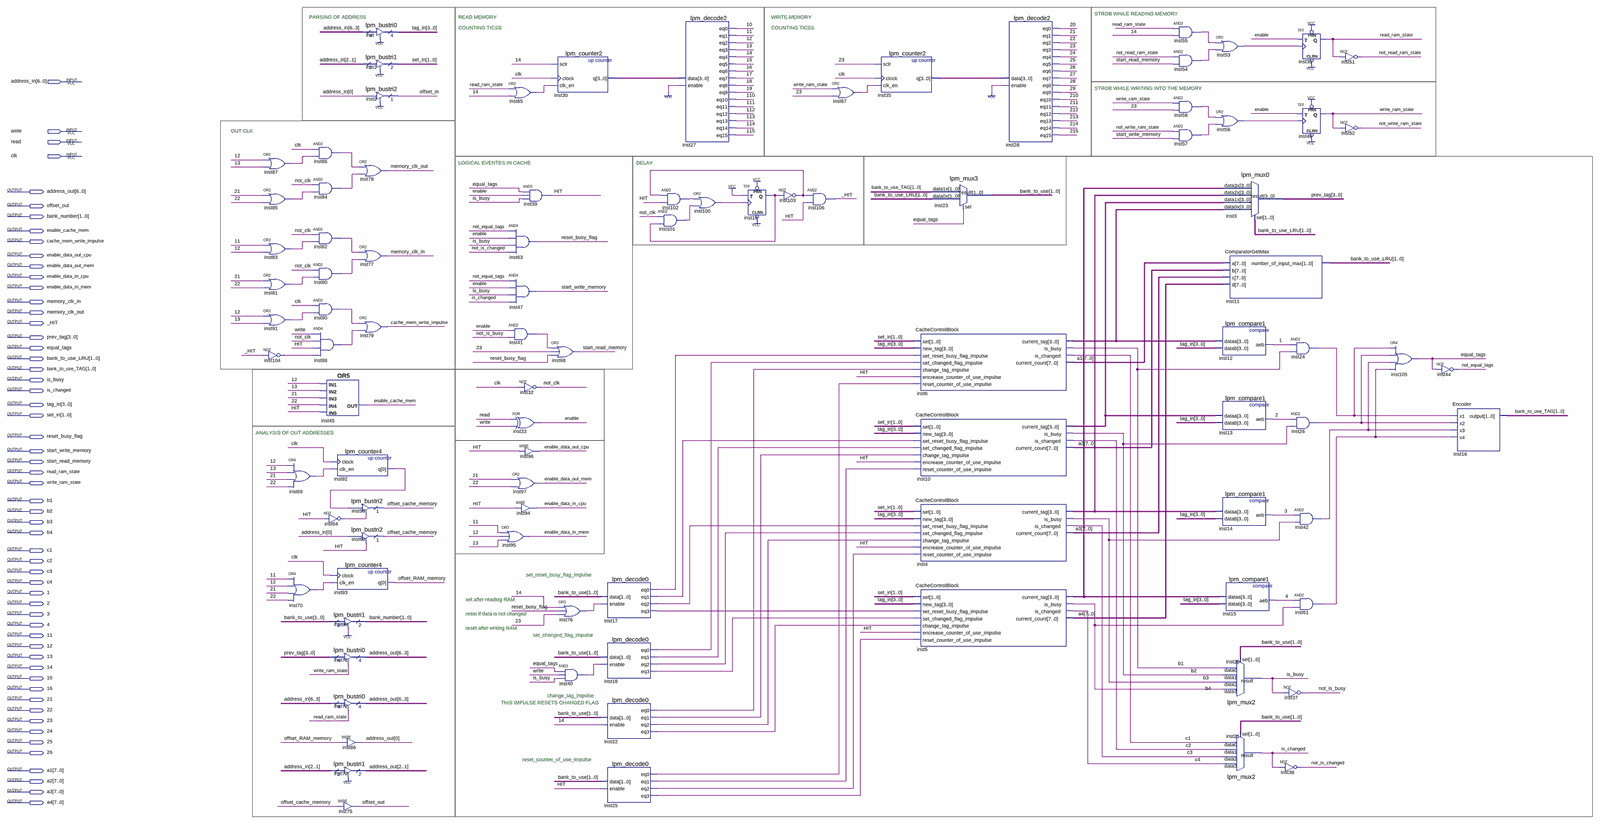
[diagram p0: schematic sheet, whole]
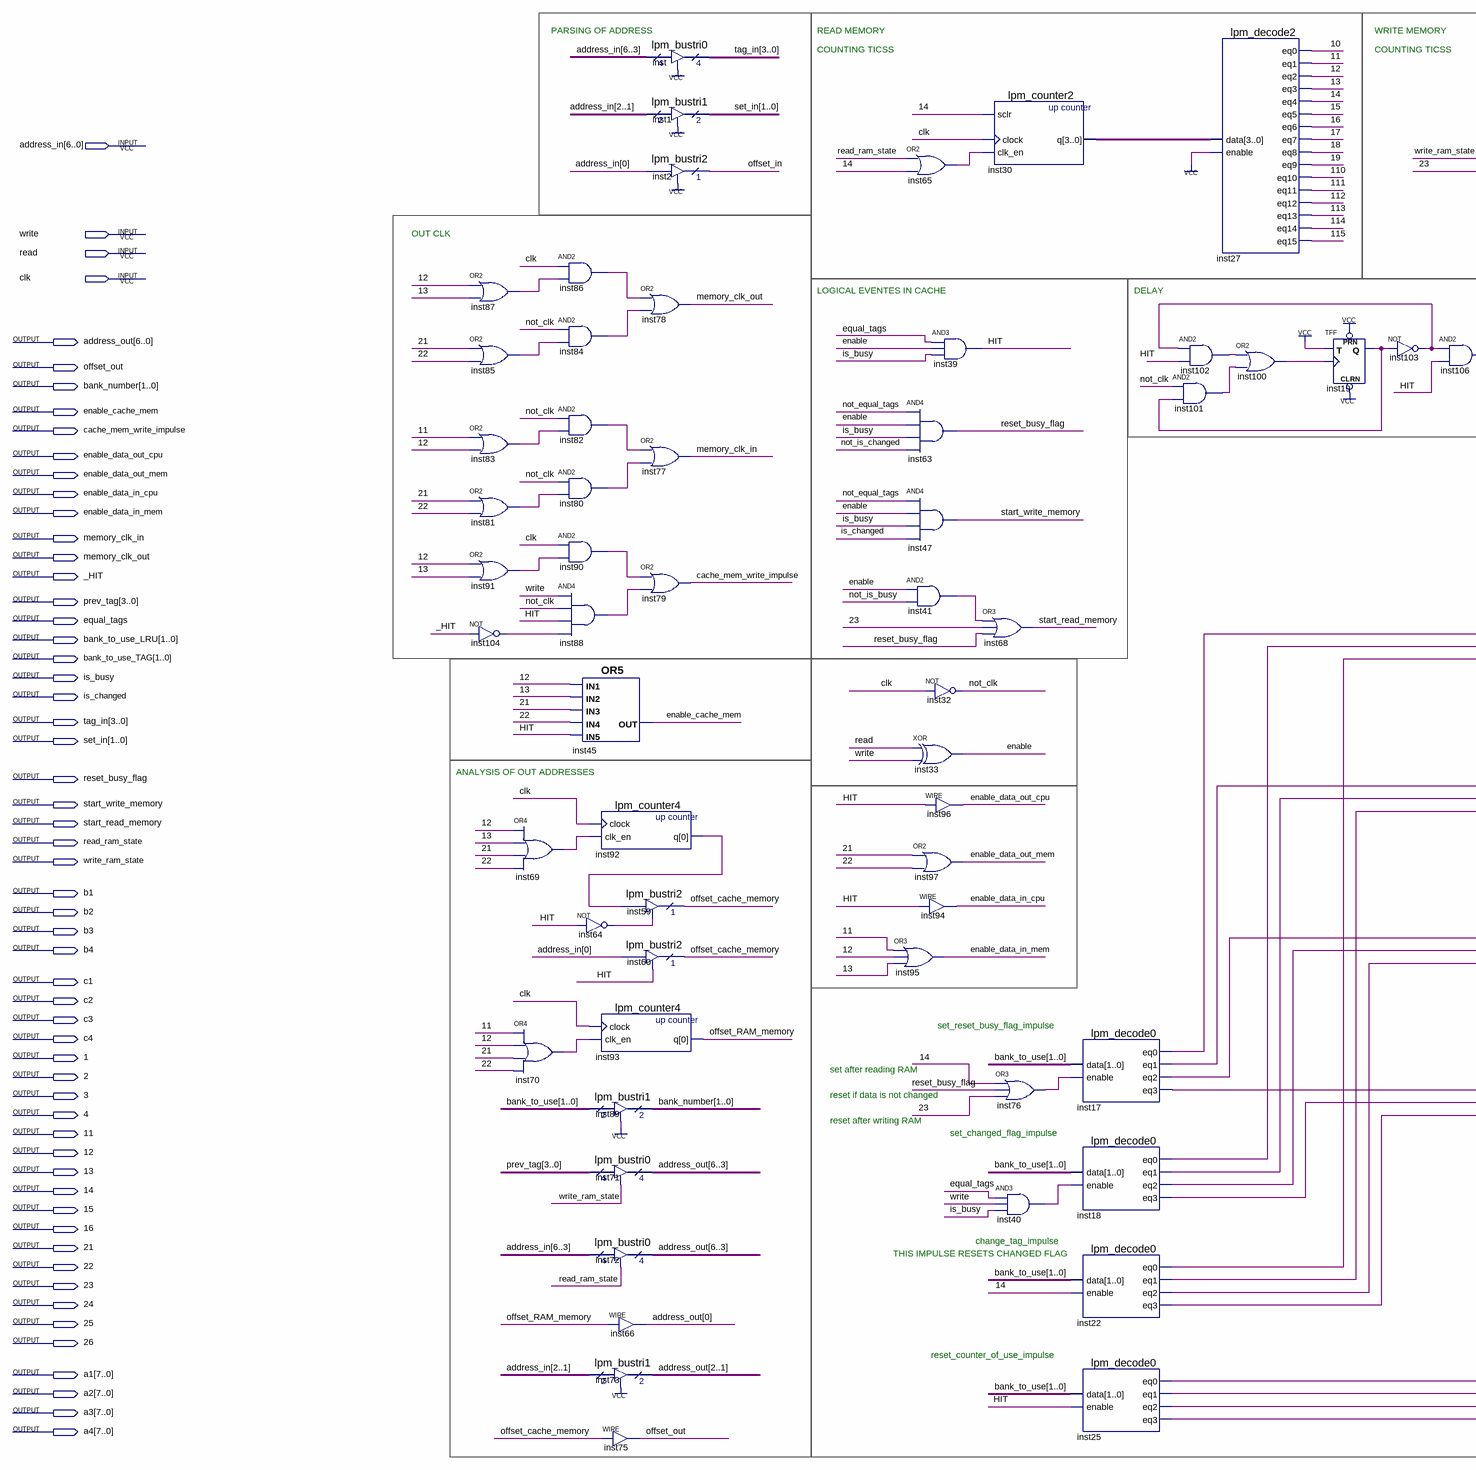
[diagram p1: schematic sheet, left part]
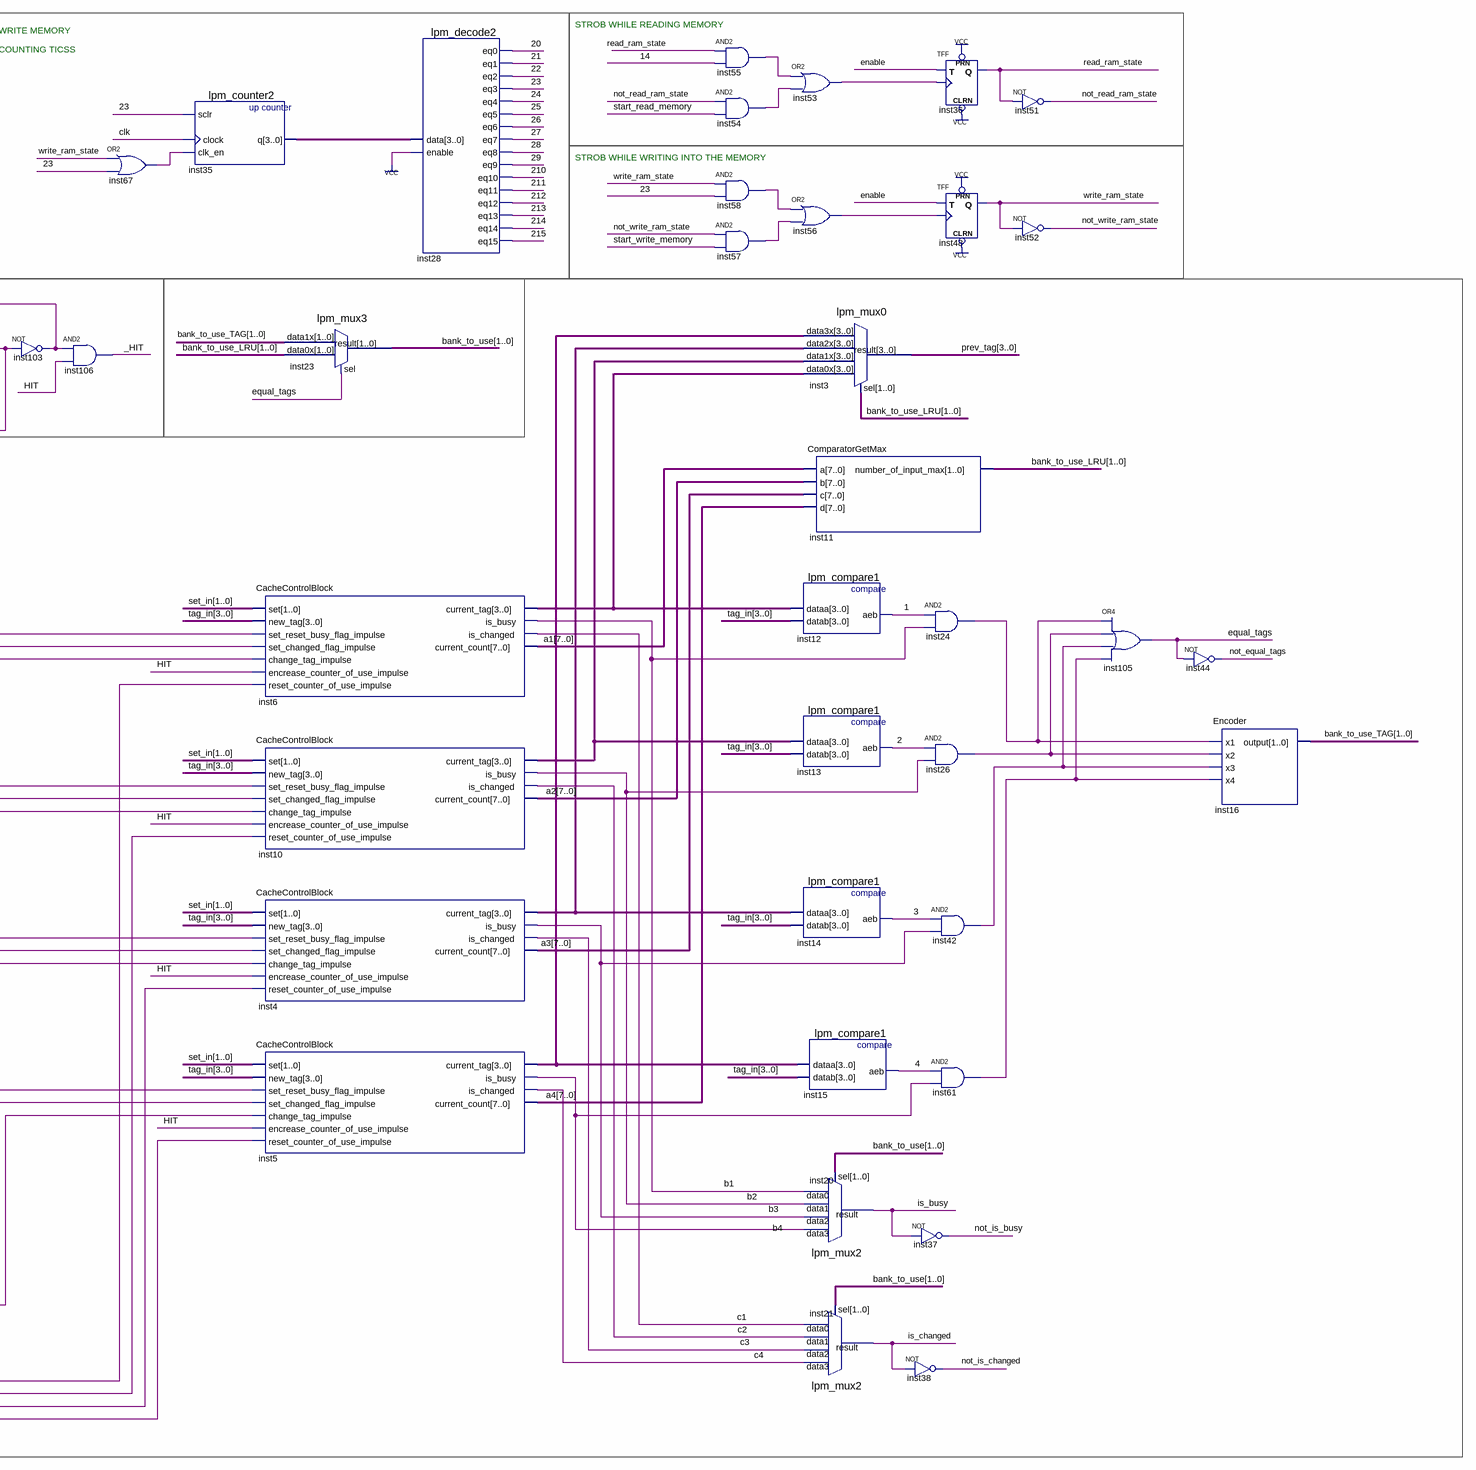
[diagram p2: schematic sheet, right part]
// Quartus schematic CacheControlUnit.bdf as structural Verilog: 93 symbols, 57 pins
module CacheControlUnit (
  input  [6:0] address_in,
  input  write,
  input  read,
  input  clk,
  output [6:0] address_out,
  output offset_out,
  output [1:0] bank_number,
  output enable_cache_mem,
  output cache_mem_write_impulse,
  output enable_data_out_cpu,
  output enable_data_out_mem,
  output enable_data_in_cpu,
  output enable_data_in_mem,
  output memory_clk_in,
  output memory_clk_out,
  output _HIT,
  output [3:0] prev_tag,
  output equal_tags,
  output [1:0] bank_to_use_LRU,
  output [1:0] bank_to_use_TAG,
  output is_busy,
  output is_changed,
  output [3:0] tag_in,
  output [1:0] set_in,
  output reset_busy_flag,
  output start_write_memory,
  output start_read_memory,
  output read_ram_state,
  output write_ram_state,
  output b1,
  output b2,
  output b3,
  output b4,
  output c1,
  output c2,
  output c3,
  output c4,
  output \1 ,
  output \2 ,
  output \3 ,
  output \4 ,
  output \11 ,
  output \12 ,
  output \13 ,
  output \14 ,
  output \15 ,
  output \16 ,
  output \21 ,
  output \22 ,
  output \23 ,
  output \24 ,
  output \25 ,
  output \26 ,
  output [7:0] a1,
  output [7:0] a2,
  output [7:0] a3,
  output [7:0] a4
);

  wire \10 , \17 , \18 , \19 , \20 , \27 , \28 , \29 , \110 , \111 , \112 , \113 , \114 , \115 , \210 ,
       \211 , \212 , \213 , \214 , \215 , enable, HIT, inst17_eq0, inst17_eq1, inst17_eq2, inst17_eq3,
       inst18_eq0, inst18_eq1, inst18_eq2, inst18_eq3, inst19_q, inst22_eq0, inst22_eq1, inst22_eq2,
       inst22_eq3, inst24_out, inst25_eq0, inst25_eq1, inst25_eq2, inst25_eq3, inst26_out, inst40_out,
       inst41_out, inst42_out, inst53_out, inst54_out, inst55_out, inst56_out, inst57_out, inst58_out,
       inst61_out, inst64_out, inst65_out, inst67_out, inst69_out, inst70_out, inst76_out, inst80_out,
       inst81_out, inst82_out, inst83_out, inst84_out, inst85_out, inst86_out, inst87_out, inst88_out,
       inst90_out, inst91_out, inst92_q, inst100_out, inst101_out, inst102_out, inst103_out, inst104_out,
       not_clk, not_equal_tags, not_is_busy, not_is_changed, not_read_ram_state, not_write_ram_state,
       offset_cache_memory, offset_in, offset_RAM_memory;
  wire [1:0] bank_to_use;
  wire [3:0] inst4_current_tag, inst5_current_tag, inst6_current_tag, inst10_current_tag, inst30_q, inst35_q;

  or inst87 (inst87_out, \12 , \13 );
  or inst85 (inst85_out, \21 , \22 );
  or inst83 (inst83_out, \11 , \12 );
  or inst81 (inst81_out, \21 , \22 );
  or inst91 (inst91_out, \12 , \13 );
  not inst104 (inst104_out, _HIT);
  or inst69 (inst69_out, \12 , \13 , \21 , \22 );
  or inst70 (inst70_out, \11 , \12 , \21 , \22 );
  and inst86 (inst86_out, clk, inst87_out);
  and inst84 (inst84_out, not_clk, inst85_out);
  and inst82 (inst82_out, not_clk, inst83_out);
  and inst80 (inst80_out, not_clk, inst81_out);
  and inst90 (inst90_out, clk, inst91_out);
  and inst88 (inst88_out, write, not_clk, HIT, inst104_out);
  or inst45 (enable_cache_mem, \12 , \13 , \21 , \22 , HIT);
  lpm_counter4 inst92 (.clock(clk), .clk_en(inst69_out), .q(inst92_q));
  not inst64 (inst64_out, HIT);
  lpm_counter4 inst93 (.clock(clk), .clk_en(inst70_out), .q(offset_RAM_memory));
  lpm_bustri1 inst89 (.enabledt(1'b1), .data(bank_to_use), .tridata(bank_number));
  lpm_bustri0 inst71 (.enabledt(write_ram_state), .data(prev_tag), .tridata(address_out[6:3]));
  lpm_bustri0 inst72 (.enabledt(read_ram_state), .data(address_in[6:3]), .tridata(address_out[6:3]));
  lpm_bustri1 inst73 (.enabledt(1'b1), .data(address_in[2:1]), .tridata(address_out[2:1]));
  lpm_bustri0 inst (.enabledt(1'b1), .data(address_in[6:3]), .tridata(tag_in));
  lpm_bustri1 inst1 (.enabledt(1'b1), .data(address_in[2:1]), .tridata(set_in));
  lpm_bustri2 inst2 (.enabledt(1'b1), .data(address_in[0]), .tridata(offset_in));
  or inst78 (memory_clk_out, inst86_out, inst84_out);
  or inst77 (memory_clk_in, inst82_out, inst80_out);
  or inst79 (cache_mem_write_impulse, inst90_out, inst88_out);
  lpm_bustri2 inst59 (.enabledt(inst64_out), .data(inst92_q), .tridata(offset_cache_memory));
  lpm_bustri2 inst60 (.enabledt(HIT), .data(address_in[0]), .tridata(offset_cache_memory));
  assign address_out[0] = offset_RAM_memory;  // WIRE inst66
  assign offset_out = offset_cache_memory;  // WIRE inst75
  or inst95 (enable_data_in_mem, \11 , \12 , \13 );
  or inst65 (inst65_out, read_ram_state, \14 );
  and inst39 (HIT, equal_tags, enable, is_busy);
  and inst63 (reset_busy_flag, not_equal_tags, enable, is_busy, not_is_changed);
  and inst47 (start_write_memory, not_equal_tags, enable, is_busy, is_changed);
  and inst41 (inst41_out, enable, not_is_busy);
  not inst32 (not_clk, clk);
  xor inst33 (enable, read, write);
  assign enable_data_out_cpu = HIT;  // WIRE inst96
  or inst97 (enable_data_out_mem, \21 , \22 );
  assign enable_data_in_cpu = HIT;  // WIRE inst94
  lpm_counter2 inst30 (.sclr(\14 ), .clock(clk), .clk_en(inst65_out), .q(inst30_q));
  or inst68 (start_read_memory, inst41_out, \23 , reset_busy_flag);
  or inst76 (inst76_out, \14 , reset_busy_flag, \23 );
  and inst40 (inst40_out, equal_tags, write, is_busy);
  lpm_decode0 inst17 (
    .data(bank_to_use), .enable(inst76_out), .eq0(inst17_eq0), .eq1(inst17_eq1), .eq2(inst17_eq2),
    .eq3(inst17_eq3));
  lpm_decode0 inst18 (
    .data(bank_to_use), .enable(inst40_out), .eq0(inst18_eq0), .eq1(inst18_eq1), .eq2(inst18_eq2),
    .eq3(inst18_eq3));
  lpm_decode0 inst22 (
    .data(bank_to_use), .enable(\14 ), .eq0(inst22_eq0), .eq1(inst22_eq1), .eq2(inst22_eq2), .eq3(inst22_eq3));
  lpm_decode0 inst25 (
    .data(bank_to_use), .enable(HIT), .eq0(inst25_eq0), .eq1(inst25_eq1), .eq2(inst25_eq2), .eq3(inst25_eq3));
  and inst102 (inst102_out, inst103_out, HIT);
  and inst101 (inst101_out, not_clk, inst19_q);
  lpm_decode2 inst27 (
    .data(inst30_q), .enable(1'b1), .eq0(\10 ), .eq1(\11 ), .eq2(\12 ), .eq3(\13 ), .eq4(\14 ), .eq5(\15 ),
    .eq6(\16 ), .eq7(\17 ), .eq8(\18 ), .eq9(\19 ), .eq10(\110 ), .eq11(\111 ), .eq12(\112 ), .eq13(\113 ),
    .eq14(\114 ), .eq15(\115 ));
  or inst100 (inst100_out, inst102_out, inst101_out);
  TFF inst19 (.PRN(1'b1), .CLRN(1'b1), .T(1'b1), .CLK(inst100_out), .Q(inst19_q));
  not inst103 (inst103_out, inst19_q);
  and inst106 (_HIT, inst103_out, HIT);
  or inst67 (inst67_out, write_ram_state, \23 );
  lpm_counter2 inst35 (.sclr(\23 ), .clock(clk), .clk_en(inst67_out), .q(inst35_q));
  lpm_mux3 inst23 (.data1x(bank_to_use_TAG), .data0x(bank_to_use_LRU), .sel(equal_tags), .result(bank_to_use));
  CacheControlBlock inst6 (
    .set(set_in), .new_tag(tag_in), .set_reset_busy_flag_impulse(inst17_eq0),
    .set_changed_flag_impulse(inst18_eq0), .change_tag_impulse(inst22_eq0),
    .encrease_counter_of_use_impulse(HIT), .reset_counter_of_use_impulse(inst25_eq0),
    .current_tag(inst6_current_tag), .is_busy(b1), .is_changed(c1), .current_count(a1));
  CacheControlBlock inst10 (
    .set(set_in), .new_tag(tag_in), .set_reset_busy_flag_impulse(inst17_eq1),
    .set_changed_flag_impulse(inst18_eq1), .change_tag_impulse(inst22_eq1),
    .encrease_counter_of_use_impulse(HIT), .reset_counter_of_use_impulse(inst25_eq1),
    .current_tag(inst10_current_tag), .is_busy(b2), .is_changed(c2), .current_count(a2));
  CacheControlBlock inst4 (
    .set(set_in), .new_tag(tag_in), .set_reset_busy_flag_impulse(inst17_eq2),
    .set_changed_flag_impulse(inst18_eq2), .change_tag_impulse(inst22_eq2),
    .encrease_counter_of_use_impulse(HIT), .reset_counter_of_use_impulse(inst25_eq2),
    .current_tag(inst4_current_tag), .is_busy(b3), .is_changed(c3), .current_count(a3));
  CacheControlBlock inst5 (
    .set(set_in), .new_tag(tag_in), .set_reset_busy_flag_impulse(inst17_eq3),
    .set_changed_flag_impulse(inst18_eq3), .change_tag_impulse(inst22_eq3),
    .encrease_counter_of_use_impulse(HIT), .reset_counter_of_use_impulse(inst25_eq3),
    .current_tag(inst5_current_tag), .is_busy(b4), .is_changed(c4), .current_count(a4));
  lpm_decode2 inst28 (
    .data(inst35_q), .enable(1'b1), .eq0(\20 ), .eq1(\21 ), .eq2(\22 ), .eq3(\23 ), .eq4(\24 ), .eq5(\25 ),
    .eq6(\26 ), .eq7(\27 ), .eq8(\28 ), .eq9(\29 ), .eq10(\210 ), .eq11(\211 ), .eq12(\212 ), .eq13(\213 ),
    .eq14(\214 ), .eq15(\215 ));
  and inst55 (inst55_out, read_ram_state, \14 );
  and inst54 (inst54_out, not_read_ram_state, start_read_memory);
  and inst58 (inst58_out, write_ram_state, \23 );
  and inst57 (inst57_out, not_write_ram_state, start_write_memory);
  or inst53 (inst53_out, inst55_out, inst54_out);
  or inst56 (inst56_out, inst58_out, inst57_out);
  lpm_compare1 inst12 (.dataa(inst6_current_tag), .datab(tag_in), .aeb(\1 ));
  lpm_compare1 inst13 (.dataa(inst10_current_tag), .datab(tag_in), .aeb(\2 ));
  lpm_compare1 inst14 (.dataa(inst4_current_tag), .datab(tag_in), .aeb(\3 ));
  lpm_mux0 inst3 (
    .data3x(inst5_current_tag), .data2x(inst4_current_tag), .data1x(inst10_current_tag),
    .data0x(inst6_current_tag), .sel(bank_to_use_LRU), .result(prev_tag));
  ComparatorGetMax inst11 (.a(a1), .b(a2), .c(a3), .d(a4), .number_of_input_max(bank_to_use_LRU));
  lpm_compare1 inst15 (.dataa(inst5_current_tag), .datab(tag_in), .aeb(\4 ));
  lpm_mux2 inst20 (.data3(b4), .data2(b3), .data1(b2), .data0(b1), .sel(bank_to_use), .result(is_busy));
  lpm_mux2 inst21 (.data3(c4), .data2(c3), .data1(c2), .data0(c1), .sel(bank_to_use), .result(is_changed));
  TFF inst36 (.PRN(1'b1), .CLRN(1'b1), .T(enable), .CLK(inst53_out), .Q(read_ram_state));
  TFF inst48 (.PRN(1'b1), .CLRN(1'b1), .T(enable), .CLK(inst56_out), .Q(write_ram_state));
  and inst24 (inst24_out, \1 , b1);
  and inst26 (inst26_out, \2 , b2);
  and inst42 (inst42_out, \3 , b3);
  and inst61 (inst61_out, \4 , b4);
  not inst37 (not_is_busy, is_busy);
  not inst38 (not_is_changed, is_changed);
  not inst51 (not_read_ram_state, read_ram_state);
  not inst52 (not_write_ram_state, write_ram_state);
  or inst105 (equal_tags, inst24_out, inst26_out, inst42_out, inst61_out);
  not inst44 (not_equal_tags, equal_tags);
  Encoder inst16 (.x1(inst24_out), .x2(inst26_out), .x3(inst42_out), .x4(inst61_out), .\output (bank_to_use_TAG));

  // Notes on the sheet:
  //   STROB WHILE READING MEMORY
  //   PARSING OF ADDRESS
  //   READ MEMORY
  //   WRITE MEMORY
  //   COUNTING TICSS
  //   COUNTING TICSS
  //   STROB WHILE WRITING INTO THE MEMORY
  //   OUT CLK
  //   LOGICAL EVENTES IN CACHE
  //   DELAY
  //   ANALYSIS OF OUT ADDRESSES
  //   set_reset_busy_flag_impulse
  //   set after reading RAM
  //   reset if data is not changed
  //   reset after writing RAM
  //   set_changed_flag_impulse
  //   change_tag_impulse
  //   THIS IMPULSE RESETS CHANGED FLAG
  //   reset_counter_of_use_impulse
endmodule
